# Altium project io9.PrjPcb
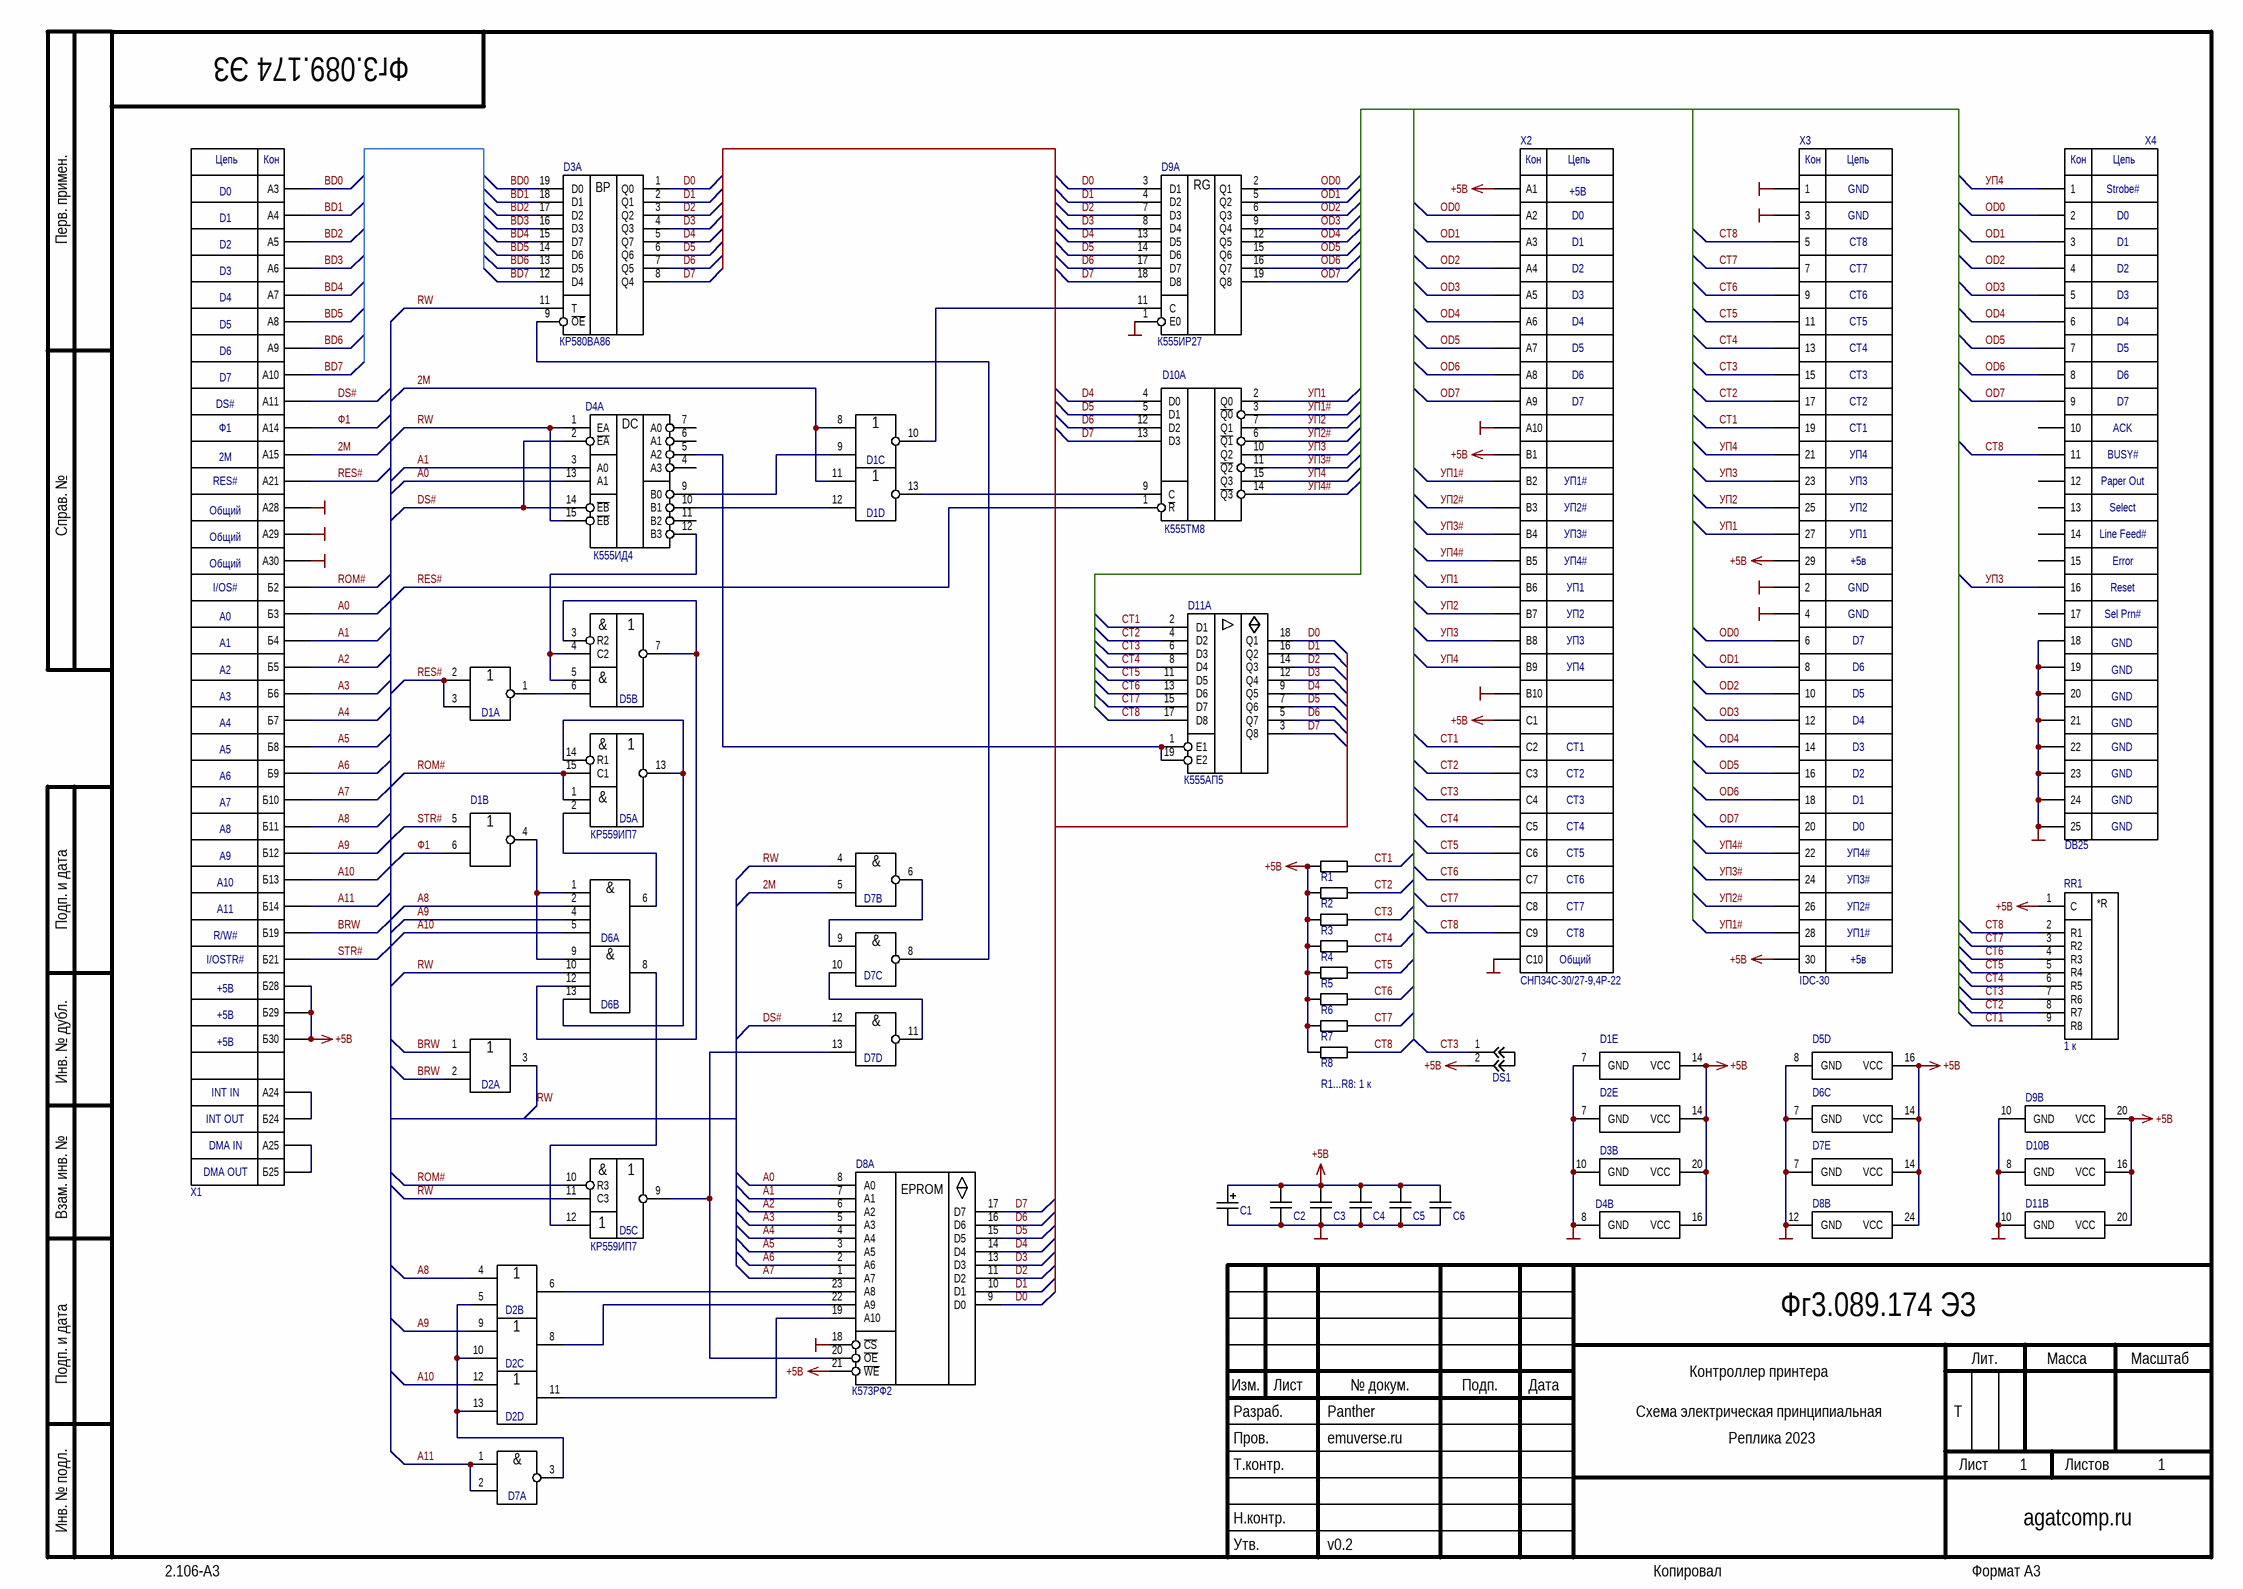
[diagram p0: io9.SchDoc]
1 sheet, 31 parts. Net scope: global (net labels, ports and power ports of the same name join across sheets).
Board files: io9_snp.PcbDoc, io9_idc.PcbDoc

## Sheet io9.SchDoc: Контроллер принтера
size 420 x 297 mm; ApprovedBy: v0.2; CheckedBy: emuverse.ru; Author: Panther; CompanyName: agatcomp.ru; DocumentNumber: Фг3.089.174 ЭЗ; SheetNumber: 1; SheetTotal: 1; Title2str: Схема электрическая принципиальная; DocumentType: Реплика 2023; Letter1Column: T

### Parts
C1  47,0 х 16 в  [CP30]  (value not drawn)
C2  0,1 мкф  [C5]  (value not drawn)
C3  0,1 мкф  [C5]  (value not drawn)
C4  0,1 мкф  [C5]  (value not drawn)
C5  0,1 мкф  [C5]  (value not drawn)
C6  0,1 мкф  [C5]  (value not drawn)
D1  К555ЛЕ1  [201.14]  (value not drawn)  (parts A,B,C,D,E of 5)
D2  К555ЛЛ1  [201.14]  (value not drawn)  (parts A,B,C,D,E of 5)
D3  КР580ВА86  [2140.20]  (parts A,B of 2)
D4  К555ИД4  [201.16]  (parts A,B of 2)
D5  КР559ИП7  [201.16]  (parts A,B,C,D of 4)
D6  К555ЛИ6  [201.14]  (value not drawn)  (parts A,B,C of 3)
D7  К555ЛА3  [201.14]  (value not drawn)  (parts A,B,C,D,E of 5)
D8  К573РФ2  [2120.24 socket]  (parts A,B of 2)
D9  К555ИР27  [201.20]  (parts A,B of 2)
D10  К555ТМ8  [201.16]  (parts A,B of 2)
D11  К555АП5  [201.20]  (parts A,B of 2)
DS1  HEADER_2x1  [HEADER_2x1]  (value not drawn)
R1  1 к  [R10]  (value not drawn)
R2  1 к  [R10]  (value not drawn)
R3  1 к  [R10]  (value not drawn)
R4  1 к  [R10]  (value not drawn)
R5  1 к  [R10]  (value not drawn)
R6  1 к  [R10]  (value not drawn)
R7  1 к  [R10]  (value not drawn)
R8  1 к  [R10]  (value not drawn)
RR1  1 к  [НР1-4-8]
X1  Agat-Ext-io9  [AGAT_EXT]  (value not drawn)  (no BOM)
X2  СНП34С-30/27-9,4Р-22  [СНП34-300/27х9,4Р-22-Р]
X3  IDC-30  [IDC30]
X4  DB25  [DB25]

### Nets
+5В: C1.1 C2.2 C3.2 C4.2 C5.2 C6.2 D1.14(VCC) D2.14(VCC) D3.20(VCC) D4.16(VCC) D5.16(VCC) D6.14(VCC) D7.14(VCC) D8.21(~{WE}) D8.24(VCC) D9.20(VCC) D10.16(VCC) D11.20(VCC) DS1.2 R1.2 R2.2 R3.2 R4.2 R5.2 R6.2 R7.2 R8.2 RR1.1(С) X1.B28(Б28) X1.B29(Б29) X1.B30(Б30) X2.A1 X2.B1 X2.C1 X3.29 X3.30
GND: C1.2 C2.1 C3.1 C4.1 C5.1 C6.1 D1.7(GND) D2.7(GND) D3.10(GND) D4.8(GND) D5.8(GND) D6.7(GND) D7.7(GND) D8.12(GND) D8.18(~{CS}) D9.1(E0) D9.10(GND) D10.8(GND) D11.10(GND) X1.A28 X1.A29 X1.A30 X2.A10 X2.B10 X2.C10 X3.1 X3.2 X3.3 X3.4 X4.18 X4.19 X4.20 X4.21 X4.22 X4.23 X4.24 X4.25
2M: D1.8(A) D1.11(A) D7.5(B) X1.A15
A0: D4.13(A1) D8.8(A0) X1.B3(Б3)
A1: D4.3(A0) D8.7(A1) X1.B4(Б4)
A2: D8.6(A2) X1.B5(Б5)
A3: D8.5(A3) X1.B6(Б6)
A4: D8.4(A4) X1.B7(Б7)
A5: D8.3(A5) X1.B8(Б8)
A6: D8.2(A6) X1.B9(Б9)
A7: D8.1(A7) X1.B10(Б10)
A8: D2.4(A) D6.2(B) X1.B11(Б11)
A9: D2.9(A) D6.4(C) X1.B12(Б12)
A10: D2.12(A) D6.5(В) X1.B13(Б13)
A11: D7.1(A) D7.2(B) X1.B14(Б14)
BD0: D3.19(D0) X1.A3
BD1: D3.18(D1) X1.A4
BD2: D3.17(D2) X1.A5
BD3: D3.16(D3) X1.A6
BD4: D3.15(D7) X1.A7
BD5: D3.14(D6) X1.A8
BD6: D3.13(D5) X1.A9
BD7: D3.12(D4) X1.A10
BRW: D2.1(A) D2.2(B) X1.B19(Б19)
CT1: D11.2(D1) R1.1 RR1.9(R8) X2.C2 X3.19
CT2: D11.4(D2) R2.1 RR1.8(R7) X2.C3 X3.17
CT3: D11.6(D3) DS1.1 R3.1 RR1.7(R6) X2.C4 X3.15
CT4: D11.8(D4) R4.1 RR1.6(R5) X2.C5 X3.13
CT5: D11.11(D5) R5.1 RR1.5(R4) X2.C6 X3.11
CT6: D11.13(D6) R6.1 RR1.4(R3) X2.C7 X3.9
CT7: D11.15(D7) R7.1 RR1.3(R2) X2.C8 X3.7
CT8: D11.17(D8) R8.1 RR1.2(R1) X2.C9 X3.5 X4.11
D0: D3.1(Q0) D8.9(D0) D9.3(D1) D11.18(Q1)
D1: D3.2(Q1) D8.10(D1) D9.4(D2) D11.16(Q2)
D2: D3.3(Q2) D8.11(D2) D9.7(D3) D11.14(Q3)
D3: D3.4(Q3) D8.13(D3) D9.8(D4) D11.12(Q4)
D4: D3.5(Q7) D8.14(D4) D9.13(D5) D10.4(D0) D11.9(Q5)
D5: D3.6(Q6) D8.15(D5) D9.14(D6) D10.5(D1) D11.7(Q6)
D6: D3.7(Q5) D8.16(D6) D9.17(D7) D10.12(D2) D11.5(Q7)
D7: D3.8(Q4) D8.17(D7) D9.18(D8) D10.13(D3) D11.3(Q8)
DS#: D4.2(~{EA}) D4.14(~{EB}) D7.12(A) X1.A11
OD0: D9.2(Q1) X2.A2 X3.6 X4.2
OD1: D9.5(Q2) X2.A3 X3.8 X4.3
OD2: D9.6(Q3) X2.A4 X3.10 X4.4
OD3: D9.9(Q4) X2.A5 X3.12 X4.5
OD4: D9.12(Q5) X2.A6 X3.14 X4.6
OD5: D9.15(Q6) X2.A7 X3.16 X4.7
OD6: D9.16(Q7) X2.A8 X3.18 X4.8
OD7: D9.19(Q8) X2.A9 X3.20 X4.9
RES#: D1.2(A) D1.3(B) D10.1(~{R}) X1.A21
ROM#: D5.1(A) D5.10(R3) D5.15(C1) X1.B2(Б2)
RW: D2.3(~{O}) D3.11(T) D4.1(EA) D4.15(~{EB}) D5.11(C3) D6.10(B) D7.4(A)
STR#: D1.5(A) X1.B21(Б21)
УП1: D10.2(Q0) X2.B6 X3.27
УП1#: D10.3(~{Q0}) X2.B2 X3.28
УП2: D10.7(Q1) X2.B7 X3.25
УП2#: D10.6(~{Q1}) X2.B3 X3.26
УП3: D10.10(Q2) X2.B8 X3.23 X4.16
УП3#: D10.11(~{Q2}) X2.B4 X3.24
УП4: D10.15(Q3) X2.B9 X3.21 X4.1
УП4#: D10.14(~{Q3}) X2.B5 X3.22
Ф1: D1.6(B) X1.A14
NetD1_1: D1.1(~{O}) D5.6(B)
NetD1_4: D1.4(~{O}) D6.1(A) D6.9(A)
NetD1_9: D1.9(B) D4.9(B0)
NetD1_10: D1.10(~{O}) D9.11(C)
NetD1_12: D1.12(B) D4.10(B1)
NetD1_13: D1.13(~{O}) D10.9(C)
NetD2_5: D2.5(B) D2.10(B) D2.13(B) D7.3(~{O})
NetD2_6: D2.6(~{O}) D8.23(A8)
NetD2_8: D2.8(~{O}) D8.22(A9)
NetD2_11: D2.11(~{O}) D8.19(A10)
NetD3_9: D3.9(~{OE}) D7.8(~{O})
NetD4_5: D4.5(A2) D11.1(E1) D11.19(E2)
NetD4_12: D4.12(B3) D5.4(C2) D5.5(A)
NetD5_2: D5.2(B) D6.6(~{O})
NetD5_3: D5.3(R2) D5.7(~{O}) D6.12(C)
NetD5_9: D5.9(~{O}) D7.13(B) D8.20(~{OE})
NetD5_12: D5.12(A) D6.8(~{O})
NetD5_13: D5.13(~{O}) D5.14(R1) D6.13(D)
NetD7_6: D7.6(~{O}) D7.9(A)
NetD7_10: D7.10(B) D7.11(~{O})
NetX1_A24: X1.A24 X1.B24(Б24)
NetX1_A25: X1.A25 X1.B25(Б25)

Not connected (* = marked no-connect by the designer): D4 4(A3) 6(A1) 7(A0) 11(B2); X4 10 12 13 14 15 17

### Notes on the sheet
- (near R8) R1...R8: 1 к
- Перв. примен.
- Справ. №
- Подп. и дата
- Инв. № дубл.
- Взам. инв. №
- Разраб.
- Изм.
- Лист
- № докум.
- Подп.
- Дата
- Лит.
- Масса
- Масштаб
- Пров.
- Т.контр.
- Листов
- Инв. № подл.
- Утв.
- Н.контр.
- 2.106-A3
- Копировал
- Формат А3
- (in symbol Agat-Ext-io9) Цепь; Кон; D0; D1; D2; D3; D4; D5; D6; D7; DS#; Ф1; 2М; RES#; Общий; I/OS#; A0; A1; A2; R/W#; I/OSTR#; +5В; INT IN; INT OUT; DMA IN; DMA OUT
- (in symbol DB25_LPT) Кон; Цепь; Strobe#; D0; D1; D2; D3; D4; D5; D6; D7; ACK; BUSY#; Paper Out; Select; Line Feed#; Error; Reset; Sel Prn#; GND
- (in symbol IO9_IDC30) Кон; Цепь; GND; CT8; CT7; CT6; CT5; CT4; CT3; CT2; CT1; УП4; УП3; УП2; УП1; +5в; D7; D6; D5; D4; D3; D2; D1; D0; УП4#; УП3#; УП2#; УП1#
- (in symbol IO9_OUT) Кон; Цепь; +5В; D0; D1; D2; D3; D4; D5; D6; D7; УП1#; УП2#; УП3#; УП4#; УП1; УП2; УП3; УП4; CT1; CT2; CT3; CT4; CT5; CT6; CT7; CT8; Общий
- (in symbol К555ИД4, part A) DC
- (in symbol К555ИР27, part A) RG
- (in symbol К555ЛА3, part A) &
- (in symbol К555ЛА3, part B) &
- (in symbol К555ЛА3, part C) &
- (in symbol К555ЛА3, part D) &
- (in symbol К555ЛИ6, part A) &
- (in symbol К555ЛИ6, part B) &
- (in symbol К573РФ2, part A) EPROM
- (in symbol КР559ИП7, part A) &
- (in symbol КР559ИП7, part B) &
- (in symbol КР559ИП7, part C) &
- (in symbol КР580ВА86, part A) BP
- (in symbol НР1-4-8) *R

### Library data of the parts
C1 = К53-14: Value: 47,0 х 16 в
C2-C6 = К10-17: Value: 0,1 мкф
D1 = К555ЛЕ1: ManufacturerPartNumber: К555ЛА3
D2 = К555ЛЛ1: ManufacturerPartNumber: К555ЛА3
D5 = КР559ИП7: ManufacturerPartNumber: К555ЛА3
D6 = К555ЛИ6: ManufacturerPartNumber: К555ЛА3
R1-R8 = С2-23: Резистор; Value: 1 к
RR1 = НР1-4-8: ManufacturerPartNumber: НР1-4-8; Value: 1 к
X2 = IO9_OUT
X3 = IO9_IDC30
X4 = DB25_LPT
D4 = К555ИД4: ManufacturerPartNumber: К555ИД4
D7 = К555ЛА3: ManufacturerPartNumber: К555ЛА3
D10 = К555ТМ8: ManufacturerPartNumber: К555ТМ8
DS1 = HEADER_2x1: ManufacturerPartNumber: HEADER_2x1

## Assembly variants
СНП: not fitted DS1 RR1 X3 X4
IDC: not fitted R1 R2 R3 R4 R5 R6 R7 R8 X2